# EAGLE design SparkyJrRemorandumExpansion (EAGLE 6.2)
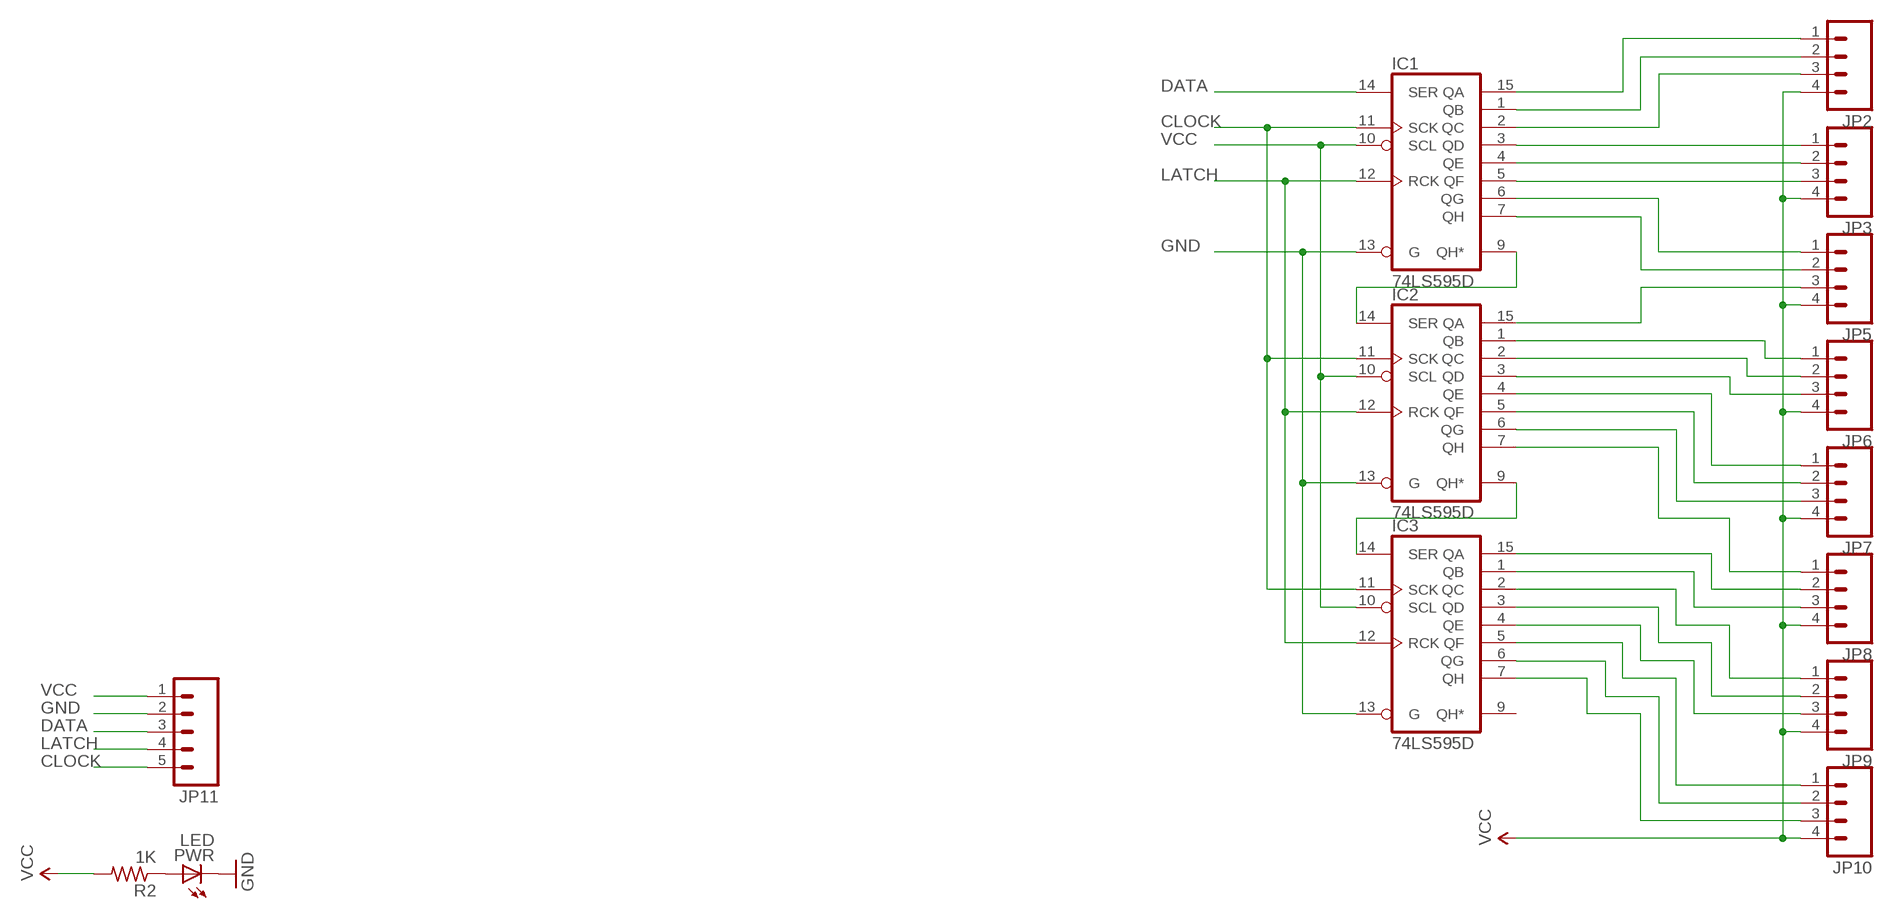
[diagram p0: schematic, sheet 1]

## Parts
IC1  74LS595D  [SO16]
IC2  74LS595D  [SO16]
IC3  74LS595D  [SO16]
JP2  M04PTH  [1X04]
JP3  M04PTH  [1X04]
JP5  M04PTH  [1X04]
JP6  M04PTH  [1X04]
JP7  M04PTH  [1X04]
JP8  M04PTH  [1X04]
JP9  M04PTH  [1X04]
JP10  M04PTH  [1X04]
JP11  M05PTH  [1X05]
PWR  LED  LEDCHIPLED_0805  [CHIPLED_0805]
R2  1K  R-US_R0805  [R0805]

## Nets
CLOCK: IC1.11(SCK) IC2.11(SCK) IC3.11(SCK) JP11.5
DATA: IC1.14(SER) JP11.3
GND: IC1.13(G) IC2.13(G) IC3.13(G) JP11.2 PWR.C
LATCH: IC1.12(RCK) IC2.12(RCK) IC3.12(RCK) JP11.4
N$1: PWR.A R2.1
N$2: IC1.9(QH*) IC2.14(SER)
N$3: IC2.9(QH*) IC3.14(SER)
N$4: IC1.15(QA) JP2.1
N$5: IC1.1(QB) JP2.2
N$6: IC1.2(QC) JP2.3
N$7: IC1.3(QD) JP3.1
N$8: IC1.4(QE) JP3.2
N$9: IC1.5(QF) JP3.3
N$10: IC1.6(QG) JP5.1
N$11: IC1.7(QH) JP5.2
N$12: IC2.15(QA) JP5.3
N$13: IC2.1(QB) JP6.1
N$14: IC2.2(QC) JP6.2
N$15: IC2.3(QD) JP6.3
N$16: IC2.4(QE) JP7.1
N$17: IC2.5(QF) JP7.2
N$18: IC2.6(QG) JP7.3
N$19: IC2.7(QH) JP8.1
N$20: IC3.15(QA) JP8.2
N$21: IC3.1(QB) JP8.3
N$22: IC3.2(QC) JP9.1
N$23: IC3.3(QD) JP9.2
N$24: IC3.4(QE) JP9.3
N$25: IC3.5(QF) JP10.1
N$26: IC3.6(QG) JP10.2
N$27: IC3.7(QH) JP10.3
VCC: IC1.10(SCL) IC2.10(SCL) IC3.10(SCL) JP2.4 JP3.4 JP5.4 JP6.4 JP7.4 JP8.4 JP9.4 JP10.4 JP11.1 R2.2
Unconnected: IC3.9(QH*)

## Power pins joined to a net without a drawn wire
GND: IC1.8(GND) IC2.8(GND) IC3.8(GND)
VCC: IC1.16(VCC) IC2.16(VCC) IC3.16(VCC)

## Library data of the parts
IC1-IC3 = 74xx-us:74*595: 8-bit SHIFT REGISTER, output latch
JP2 JP3 JP5-JP10 = SparkFun:M04: Header 4 Standard 4-pin 0.1" header. Use with straight break away headers (SKU : PRT-00116), right angle break away headers (PRT-00553), swiss pins (PRT-00743), machine pins (PRT-00117), and female headers (PRT-00115). Molex polarized connector foot print use with SKU : PRT-08231 with associated crimp pins and housings. 1MM SMD Version SKU: PRT-10208
JP11 = SparkFun:M05: Header 5 Standard 5-pin 0.1" header. Use with straight break away headers (SKU : PRT-00116), right angle break away headers (PRT-00553), swiss pins (PRT-00743), machine pins (PRT-00117), and female headers (PRT-00115). Molex polarized connector foot print use with SKU : PRT-08230 with associated crimp pins and housings.
PWR = adafruit:LED: LED OSRAM: - CHIPLED LG R971, LG N971, LY N971, LG Q971, LY Q971, LO R971, LY R971 LH N974, LH R974 LS Q976, LO Q976, LY Q976 LO Q996 - Hyper CHIPLED LW Q18S LB Q993, LB Q99A, LB R99A - SideLED LS A670, LO A670, LY A670, LG A670, LP A670 LB A673, LV A673, LT A673, LW A673 LH A674 LY A675 LS A676, LA A676, LO A676, LY A676, LW A676 LS A679, LY A679, LG A679 - Hyper Micro SIDELED® LS Y876, LA Y876, LO Y876, LY Y876 LT Y87S - SmartLED LW L88C, LW L88S LB L89C, LB L89S, LG L890 LS L89K, LO L89K, LY L89K LS L896, LA L896, LO L896, LY L896 - TOPLED LS T670, LO T670, LY T670, LG T670, LP T670 LSG T670, LSP T670, LSY T670, LOP T670, LYG T670 LG T671, LOG T671, LSG T671 LB T673, LV T673, LT T673, LW T673 LH T674 LS T676, LA T676, LO T676, LY T676, LB T676, LH T676, LSB T676, LW T676 LB T67C, LV T67C, LT T67C, LS T67K, LO T67K, LY T67K, LW E67C LS E67B, LA E67B, LO E67B, LY E67B, LB E67C, LV E67C, LT E67C LW T67C LS T679, LY T679, LG T679 LS T770, LO T770, LY T770, LG T770, LP T770 LB T773, LV T773, LT T773, LW T773 LH T774 LS E675, LA E675, LY E675, LS T675 LS T776, LA T776, LO T776, LY T776, LB T776 LHGB T686 LT T68C, LB T68C - Hyper Mini TOPLED® LB M676 - Mini TOPLED Santana® LG M470 LS M47K, LO M47K, LY M47K Source: http://www.osram.convergy.de/
R2 = adafruit:R-US_: RESISTOR, American symbol

## Board
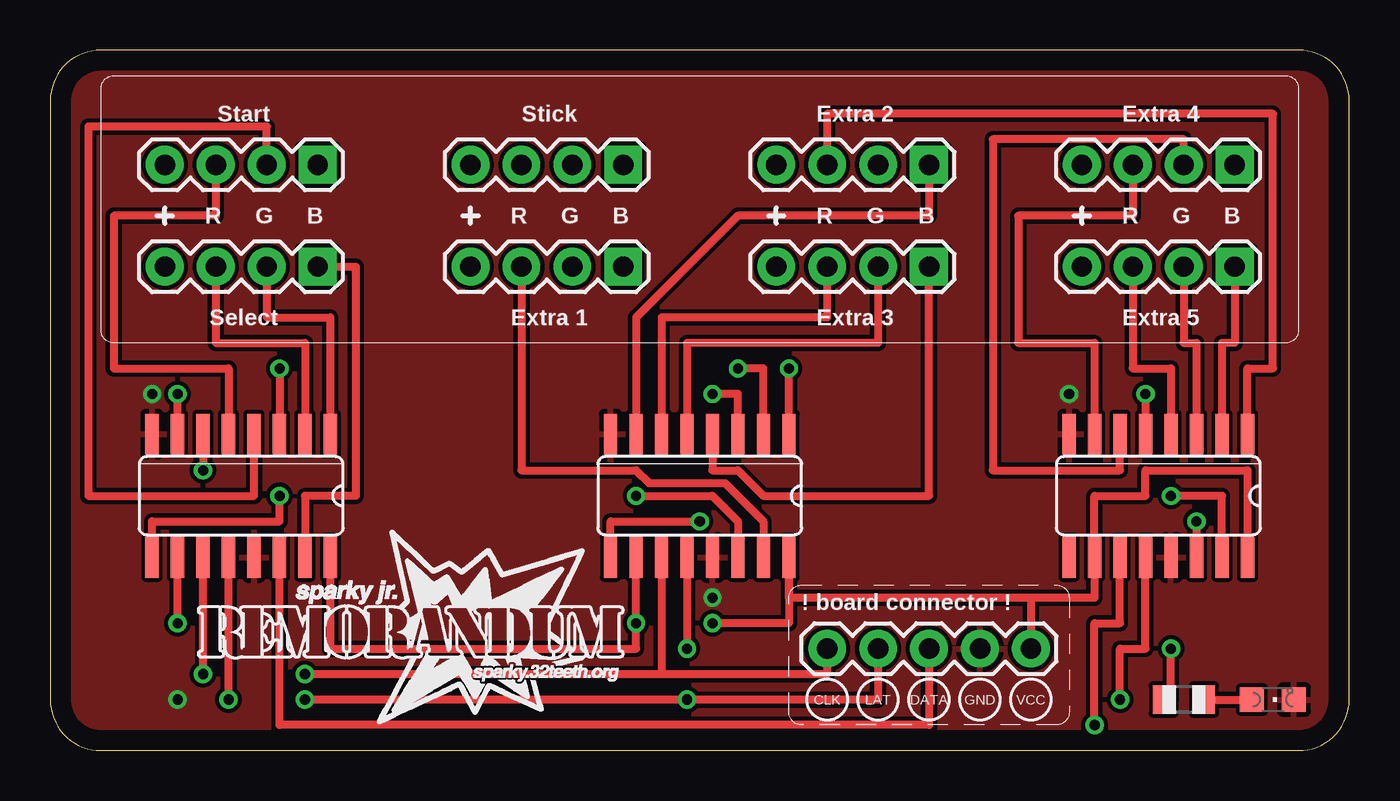
[diagram p1: board, top side]
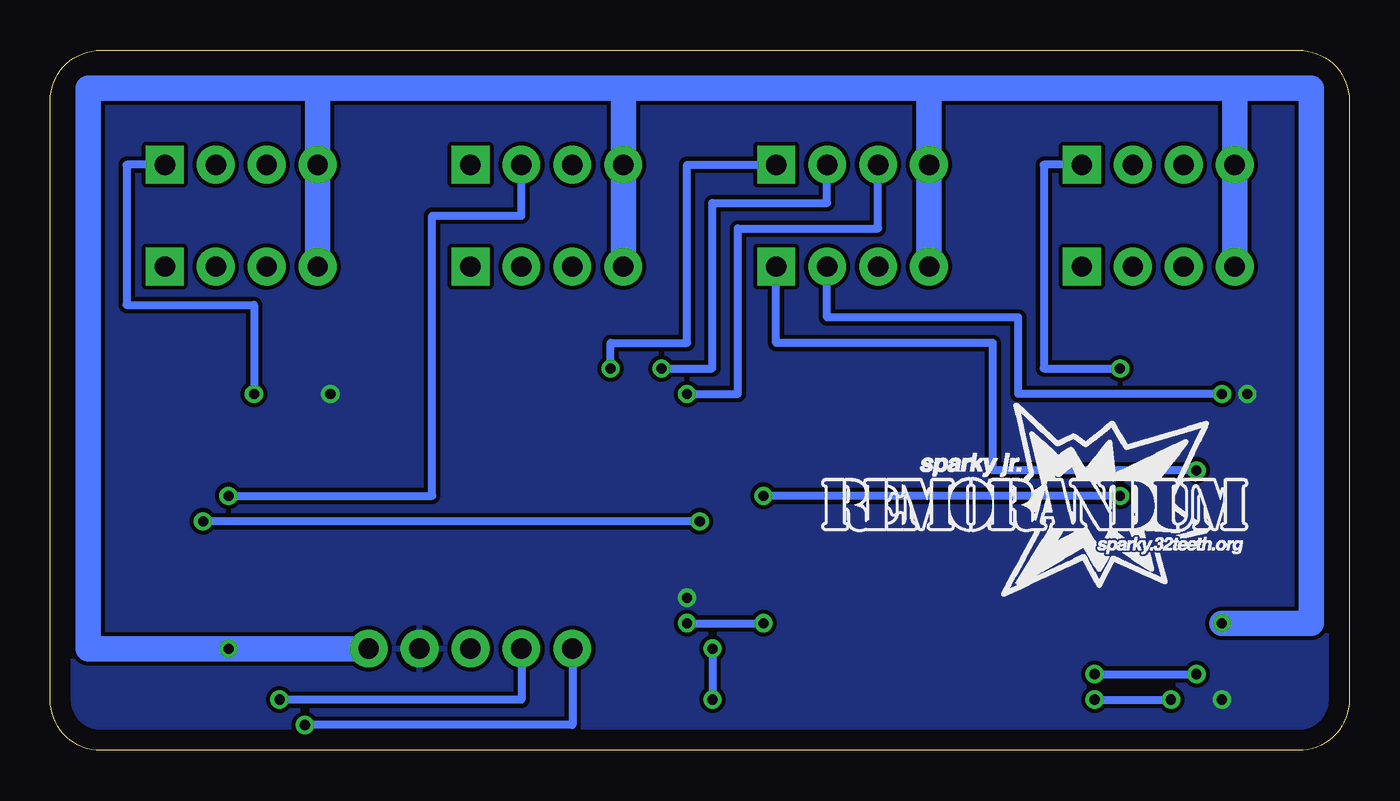
[diagram p2: board, bottom side, seen from below]

Size 64.77 x 34.92 mm. Coordinates in mm from the lower left corner, seen from the top.
Outline: 0,32.38 0,2.54 arc90 2.54,0 62.23,0 arc90 64.77,2.54 64.77,32.38 arc90 62.23,34.92 2.54,34.92 arc90 0,32.38
Copper layers (1*16): Top 0.035mm / dielectric 1.5mm / Bottom 0.035mm
Design rules: minimum track width 10mil, minimum drill 24mil, track to track 8mil, track to pad 8mil, pad to pad 8mil, via to via 8mil, smd to smd 8mil, copper to edge 40mil, drill to drill 8mil, minimum pad ring 10mil, minimum via ring 8mil, stop-mask expansion 4mil, vias tented up to drill 0mil, thermal gap 10mil

### Footprints (pad centres in the part's own frame; a part is rotated, then mirrored left to right if it is on the bottom)
SO16 = smd 0.66 x 2.032: 1 -4.445,-3.073; 2 -3.175,-3.073; 3 -1.905,-3.073; 4 -0.635,-3.073; 5 0.635,-3.073; 6 1.905,-3.073; 7 3.175,-3.073; 8 4.445,-3.073; 9 4.445,3.073; 10 3.175,3.073; 11 1.905,3.073; 12 0.635,3.073; 13 -0.635,3.073; 14 -1.905,3.073; 15 -3.175,3.073; 16 -4.445,3.073
1X04 = drill 1.016 pad 1.88 square: 1 0,0 | drill 1.016 pad 1.88: 2 2.54,0; 3 5.08,0; 4 7.62,0
1X05 = drill 1.016 pad 1.88: 1 0,0; 2 2.54,0; 3 5.08,0; 4 7.62,0; 5 10.16,0
CHIPLED_0805 = smd 1.2 x 1.2: A 0,-1.05; C 0,1.05
R0805 = smd 1.1 x 1.4: 1 -1,0; 2 1,0

### Placement (x,y rotation side)
IC1  9.53,12.7 180 top
IC2  32.38,12.7 180 top
IC3  55.24,12.7 180 top
JP2  13.34,24.13 180 top
JP3  13.34,29.21 180 top
JP5  28.57,24.13 180 top
JP6  28.57,29.21 180 top
JP7  43.81,24.13 180 top
JP8  43.81,29.21 180 top
JP9  59.05,24.13 180 top
JP10  59.05,29.21 180 top
JP11  48.9,5.08 180 top
PWR  60.96,2.54 270 top
R2  56.52,2.54 180 top

### Tracks (layer width: path | path; a pad name or v marks a point on that pad's centre or on a via)
CLOCK  (via drill 0.5)
  Top 0.406: JP11.5 38.73,3.81 30.48,3.81 | 30.48,3.81 v12.7,3.81 | v7.62,3.81 IC1.11 | IC2.11 30.48,3.81 | v52.07,1.27 52.07,6.35 53.34,6.35 IC3.11
  Bottom 0.406: v12.7,3.81 v7.62,3.81 | JP11.5 38.73,1.27 v52.07,1.27
DATA
  Top 0.406: JP11.3 43.81,1.27 11.43,1.27 IC1.14
GND  (via drill 0.5)
  other vias: 5.08,17.78 50.8,17.78 6.35,2.54 33.02,7.62
  pour Top: 0,34.92 64.77,34.92 64.77,0 0,0
  pour Bottom: 0,34.92 64.77,34.92 64.77,0 0,0
LATCH  (via drill 0.5)
  Top 0.406: JP11.4 41.27,2.54 v31.75,2.54 v12.7,2.54 | v8.89,2.54 IC1.12 | IC2.12 v31.75,5.08 | v53.34,2.54 53.34,5.08 54.61,5.08 IC3.12
  Bottom 0.406: v12.7,2.54 v8.89,2.54 | v31.75,5.08 v31.75,2.54 | JP11.4 41.27,2.54 v53.34,2.54
N$1
  Top 0.406: R2.1 PWR.A
N$2  (via drill 0.5)
  Top 0.406: IC1.9 5.08,11.43 11.43,11.43 v11.43,12.7 | v29.21,12.7 33.02,12.7 34.29,11.43 IC2.14
  Bottom 0.406: v11.43,12.7 v29.21,12.7
N$3  (via drill 0.5)
  Top 0.406: IC2.9 27.94,11.43 v32.38,11.43 | v57.15,11.43 IC3.14
  Bottom 0.406: v32.38,11.43 v57.15,11.43
N$4
  Top 0.406: JP2.1 15.24,24.13 15.24,12.7 12.7,12.7 IC1.15
N$5
  Top 0.406: JP2.2 10.79,21.59 13.97,21.59 IC1.1
N$6
  Top 0.406: JP2.3 8.26,20.32 12.7,20.32 IC1.2
N$7  (via drill 0.5)
  Top 0.406: v11.43,19.05 IC1.3
  Bottom 0.406: JP3.1 15.24,29.21 15.24,19.05 v11.43,19.05
N$8
  Top 0.406: JP3.2 10.79,31.11 1.91,31.11 1.91,12.7 10.16,12.7 IC1.4
N$9
  Top 0.406: JP3.3 8.26,26.67 3.17,26.67 3.17,19.05 8.89,19.05 IC1.5
N$10  (via drill 0.5)
  Top 0.406: IC1.6 v7.62,13.97
  Bottom 0.406: v7.62,13.97 17.78,13.97 17.78,20.32 28.57,20.32 JP5.1
N$11  (via drill 0.5)
  Top 0.406: IC1.7 v6.35,17.78
  Bottom 0.406: v6.35,17.78 16.51,17.78 16.51,21.59 26.04,21.59 JP5.2
N$12
  Top 0.406: JP5.3 23.5,13.97 29.21,13.97 29.84,13.34 33.66,13.34 35.56,11.43 IC2.15
N$13  (via drill 0.5)
  Top 0.406: IC2.1 v36.83,19.05
  Bottom 0.406: v36.83,19.05 36.83,20.32 33.02,20.32 33.02,29.21 JP6.1
N$14  (via drill 0.5)
  Top 0.406: IC2.2 35.56,19.05 v34.29,19.05
  Bottom 0.406: v34.29,19.05 31.75,19.05 31.75,27.3 26.04,27.3 JP6.2
N$15  (via drill 0.5)
  Top 0.406: IC2.3 34.29,17.78 v33.02,17.78
  Bottom 0.406: v33.02,17.78 30.48,17.78 30.48,26.04 23.5,26.04 JP6.3
N$16
  Top 0.406: IC2.4 33.02,13.97 34.29,13.97 35.56,12.7 43.81,12.7 JP7.1
N$17
  Top 0.406: JP7.2 41.27,20.32 31.75,20.32 IC2.5
N$18
  Top 0.406: JP7.3 38.73,21.59 30.48,21.59 IC2.6
N$19
  Top 0.406: JP8.1 43.81,26.67 34.29,26.67 29.21,21.59 IC2.7
N$20  (via drill 0.5)
  Top 0.406: IC3.15 58.42,12.7 v55.88,12.7
  Bottom 0.406: v55.88,12.7 45.72,12.7 45.72,26.67 41.27,26.67 JP8.2
N$21
  Top 0.406: IC3.1 59.69,19.05 60.96,19.05 60.96,31.75 38.73,31.75 JP8.3
N$22
  Top 0.406: JP9.1 59.05,20.32 58.42,20.32 IC3.2
N$23
  Top 0.406: JP9.2 56.52,20.32 57.15,20.32 IC3.3
N$24
  Top 0.406: JP9.3 53.98,19.05 55.88,19.05 IC3.4
N$25  (via drill 0.5)
  Top 0.406: v54.61,17.78 IC3.5
  Bottom 0.406: JP10.1 60.96,29.21 60.96,22.23 54.61,22.23 v54.61,17.78
N$26
  Top 0.406: JP10.2 56.52,30.48 46.99,30.48 46.99,13.97 53.34,13.97 IC3.6
N$27
  Top 0.406: JP10.3 53.98,26.67 48.26,26.67 48.26,20.32 52.07,20.32 IC3.7
VCC  (via drill 0.5)
  Top 0.406: IC3.16 59.69,13.97 54.61,13.97 54.61,12.7 52.07,12.7 IC3.10 52.07,7.62 48.9,7.62 | 48.9,7.62 JP11.1 | 48.9,7.62 36.83,7.62 IC2.16 36.83,6.35 v33.02,6.35 | v6.35,6.35 IC1.10 | R2.2 55.88,2.54 v55.88,5.08 | IC1.16 13.97,5.08 29.21,5.08 v29.21,6.35 IC2.10
  Bottom 0.406: v33.02,6.35 v29.21,6.35
  Bottom 1.27: 5.71,33.02 JP3.4 JP2.4 | 5.71,33.02 20.95,33.02 | JP11.1 v55.88,5.08 62.87,5.08 62.87,33.02 51.44,33.02 | JP7.4 JP8.4 36.2,33.02 | JP5.4 JP6.4 20.95,33.02 | 20.95,33.02 36.2,33.02 | 51.44,33.02 36.2,33.02 | 51.44,33.02 JP10.4 JP9.4 | 5.71,33.02 1.91,33.02 1.91,6.35 v6.35,6.35

### Text on the board
tPlace: Start | Stick | Extra 2 | Extra 4 | R | G | B | R | G | B | R | G | B | R | G | B | Select | Extra 1 | Extra 3 | Extra 5 | ! board connector ! | CLK | LAT | DATA | GND | VCC